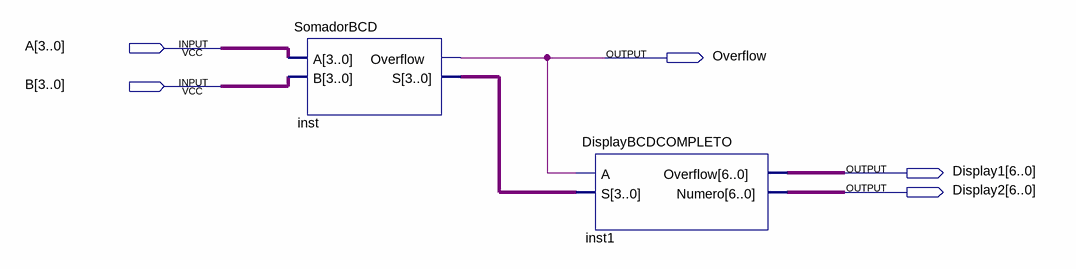
[diagram p0: schematic sheet]
// Quartus schematic BCD.bdf as structural Verilog: 2 symbols, 5 pins
module BCD (
  input  [3:0] A,
  input  [3:0] B,
  output Overflow,
  output [6:0] Display1,
  output [6:0] Display2
);

  wire [3:0] inst_s;

  SomadorBCD inst (.A(A), .B(B), .Overflow(Overflow), .S(inst_s));
  DisplayBCDCOMPLETO inst1 (.A(Overflow), .S(inst_s), .Overflow(Display1), .Numero(Display2));
endmodule
